# EAGLE schematic tomatotchi_schematic (EAGLE 7.3.0)
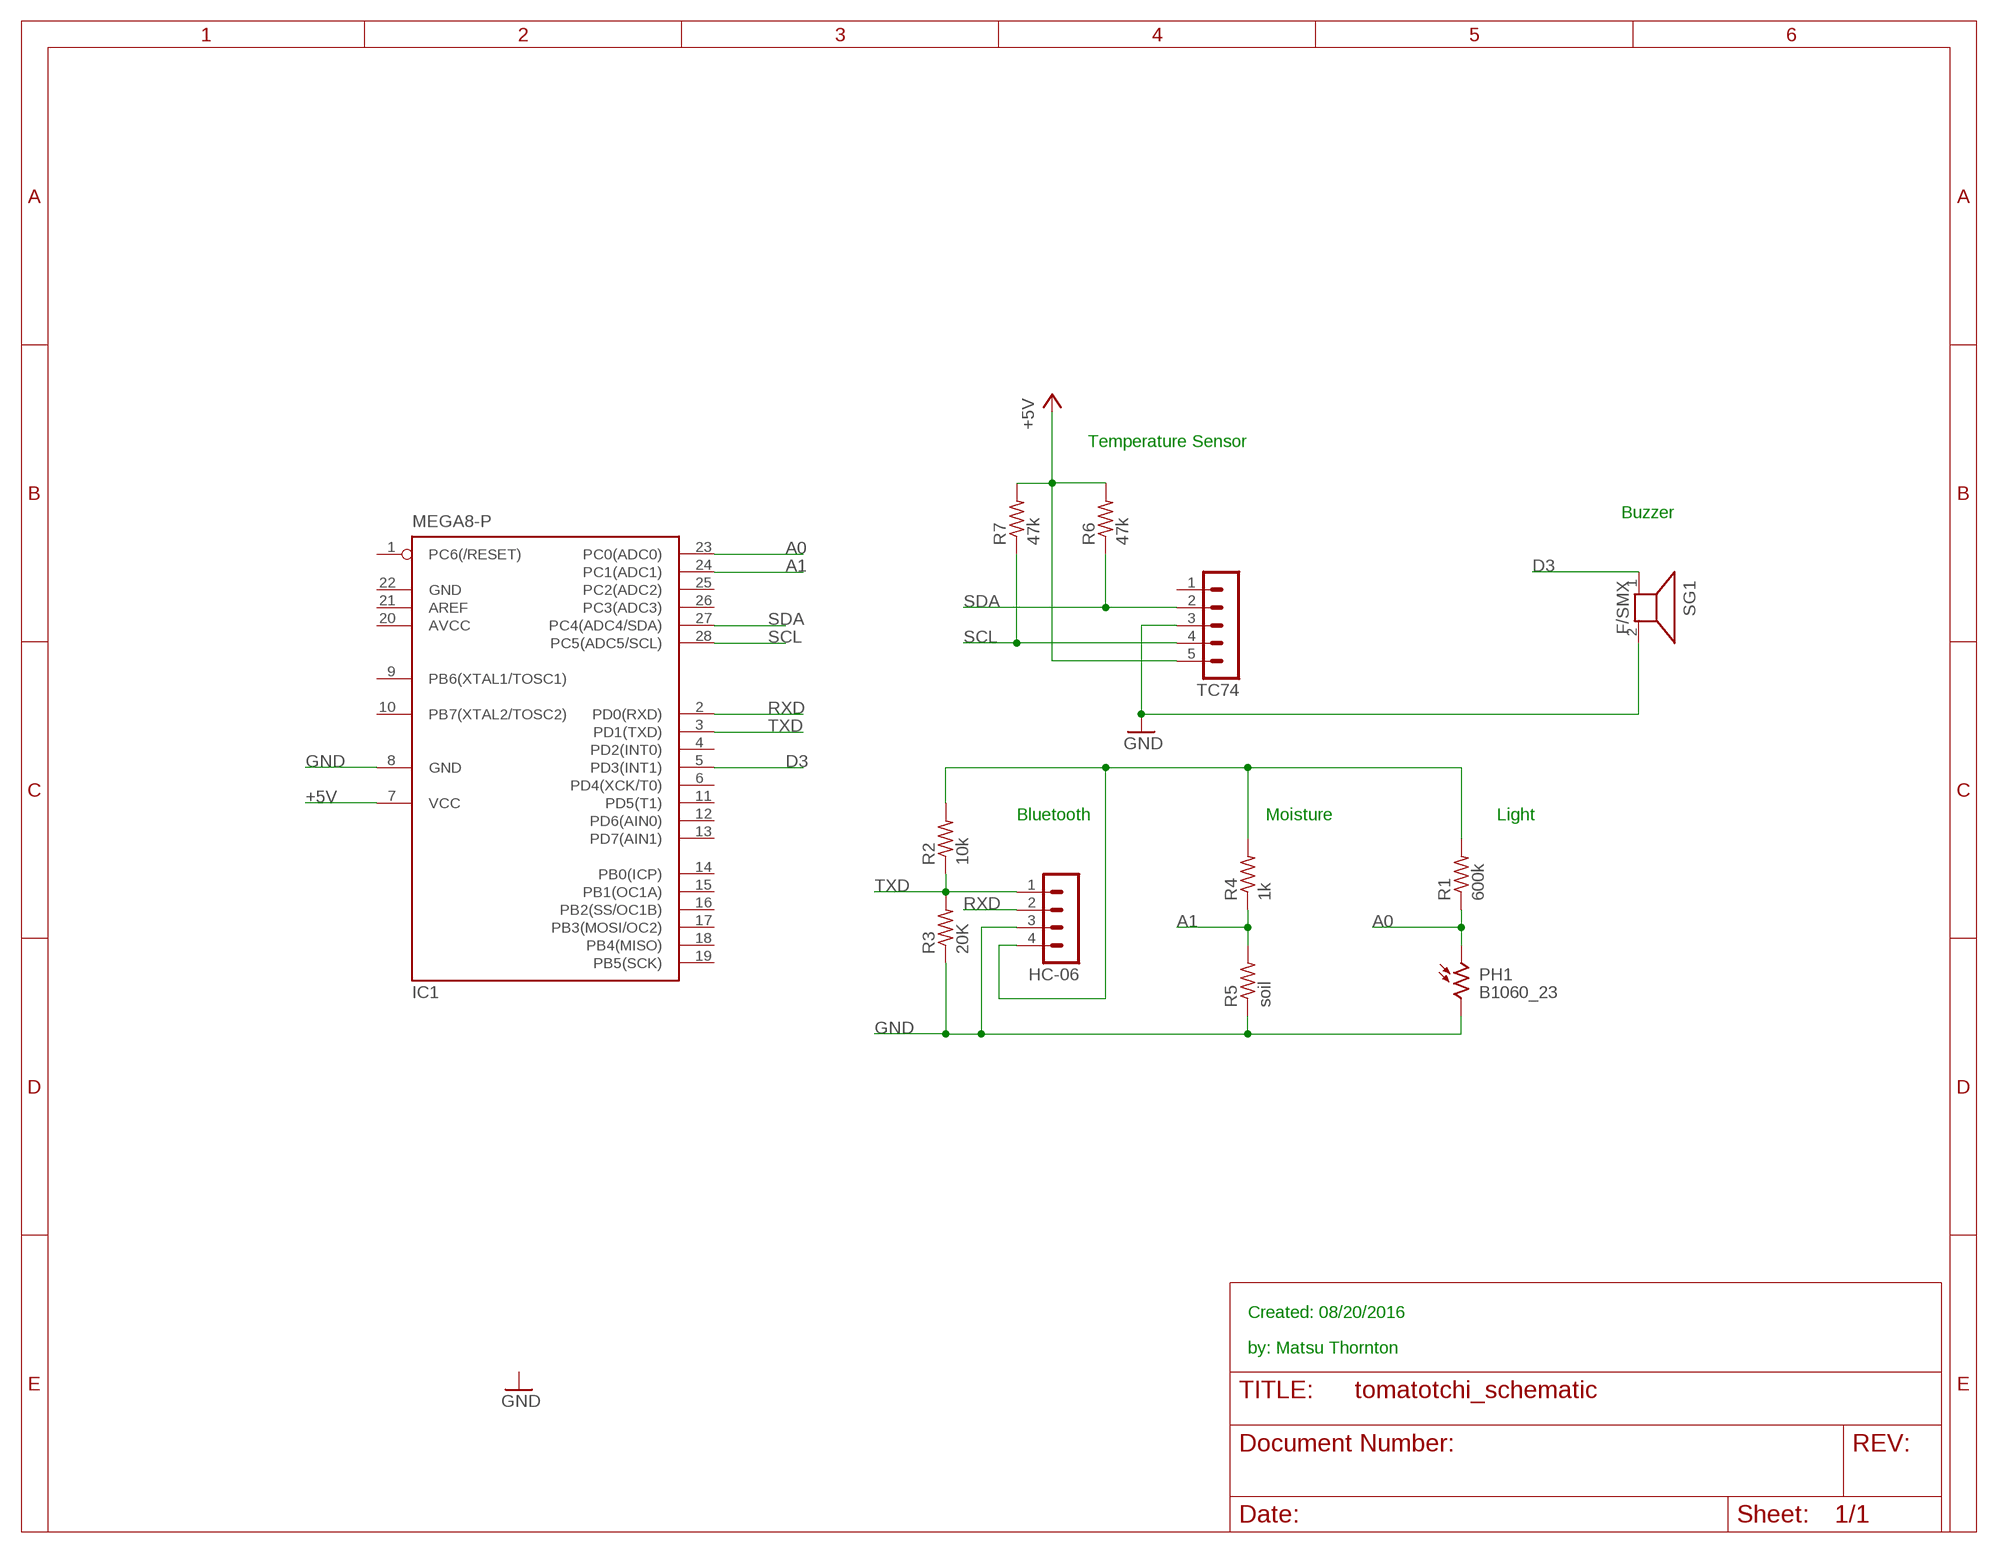
[diagram p0: schematic, sheet 1]

## Parts
HC-06  MA04-1  [MA04-1]
IC1  MEGA8-P  [DIL28-3]
PH1  B1060_23  [TO-8_B10]
R1  600k  R-US_0411/15  [0411/15]
R2  10k  R-US_0411/15  [0411/15]
R3  20K  R-US_0411/15  [0411/15]
R4  1k  R-US_0411/15  [0411/15]
R5  soil  R-US_0411/15  [0411/15]
R6  47k  R-US_0411/15  [0411/15]
R7  47k  R-US_0411/15  [0411/15]
SG1  F/SMX  [F/SMX]
TC74  MA05-1  [MA05-1]

## Nets
+5V: IC1.7(VCC) R6.2 R7.2 TC74.5
A0: IC1.23(PC0(ADC0)) PH1.1 R1.1
A1: IC1.24(PC1(ADC1)) R4.1 R5.2
D3: IC1.5(PD3(INT1)) SG1.1
GND: HC-06.3 IC1.8(GND) PH1.2 R3.1 R5.1 SG1.2 TC74.3
N$1: HC-06.4 R1.2 R2.2 R4.2
RXD: HC-06.2 IC1.2(PD0(RXD))
SCL: IC1.28(PC5(ADC5/SCL)) R7.1 TC74.4
SDA: IC1.27(PC4(ADC4/SDA)) R6.1 TC74.2
TXD: HC-06.1 IC1.3(PD1(TXD)) R2.1 R3.2
Unconnected: IC1.1(PC6(/RESET)) IC1.4(PD2(INT0)) IC1.6(PD4(XCK/T0)) IC1.9(PB6(XTAL1/TOSC1)) IC1.10(PB7(XTAL2/TOSC2)) IC1.11(PD5(T1)) IC1.12(PD6(AIN0)) IC1.13(PD7(AIN1)) IC1.14(PB0(ICP)) IC1.15(PB1(OC1A)) IC1.16(PB2(SS/OC1B)) IC1.17(PB3(MOSI/OC2)) IC1.18(PB4(MISO)) IC1.19(PB5(SCK)) IC1.21(AREF) IC1.25(PC2(ADC2)) IC1.26(PC3(ADC3)) TC74.1

## Notes on the sheet
- Temperature Sensor
- Buzzer
- Bluetooth | Moisture | Light
- Created: 08/20/2016
- by: Matsu Thornton

## Power pins joined to a net without a drawn wire
AVCC: IC1.20(AVCC)
GND: IC1.22(GND)

## Library data of the parts
HC-06 = con-lstb:MA04-1: PIN HEADER; OC_FARNELL: unknown; OC_NEWARK: unknown
IC1 = atmel:MEGA8-P: MICROCONTROLLER 8 Kbytes FLASH, 1 kbytes SRAM, 512 bytes EEPROM, USART, 4-channel 10 bit ADC, 2-channel 8 bit ADC Pin compatible with Atmega48, ATMega88, ATMega168 Source: avr.lbr; OC_FARNELL: unknown; OC_NEWARK: unknown
PH1 = photo-elements:?1060*: Sensor Street Light control Source: http://optoelectronics.perkinelmer.com/content/Datasheets/DTS_PhotocellsB1060.pdf
R1-R7 = resistor:R-US_: RESISTOR, American symbol
SG1 = buzzer:F/SMX: BUZZER Source: Buerklin; OC_FARNELL: unknown; OC_NEWARK: unknown
TC74 = con-lstb:MA05-1: PIN HEADER; OC_FARNELL: unknown; OC_NEWARK: unknown